# EAGLE design blackmagic_richardeoin (EAGLE 7.3.0)
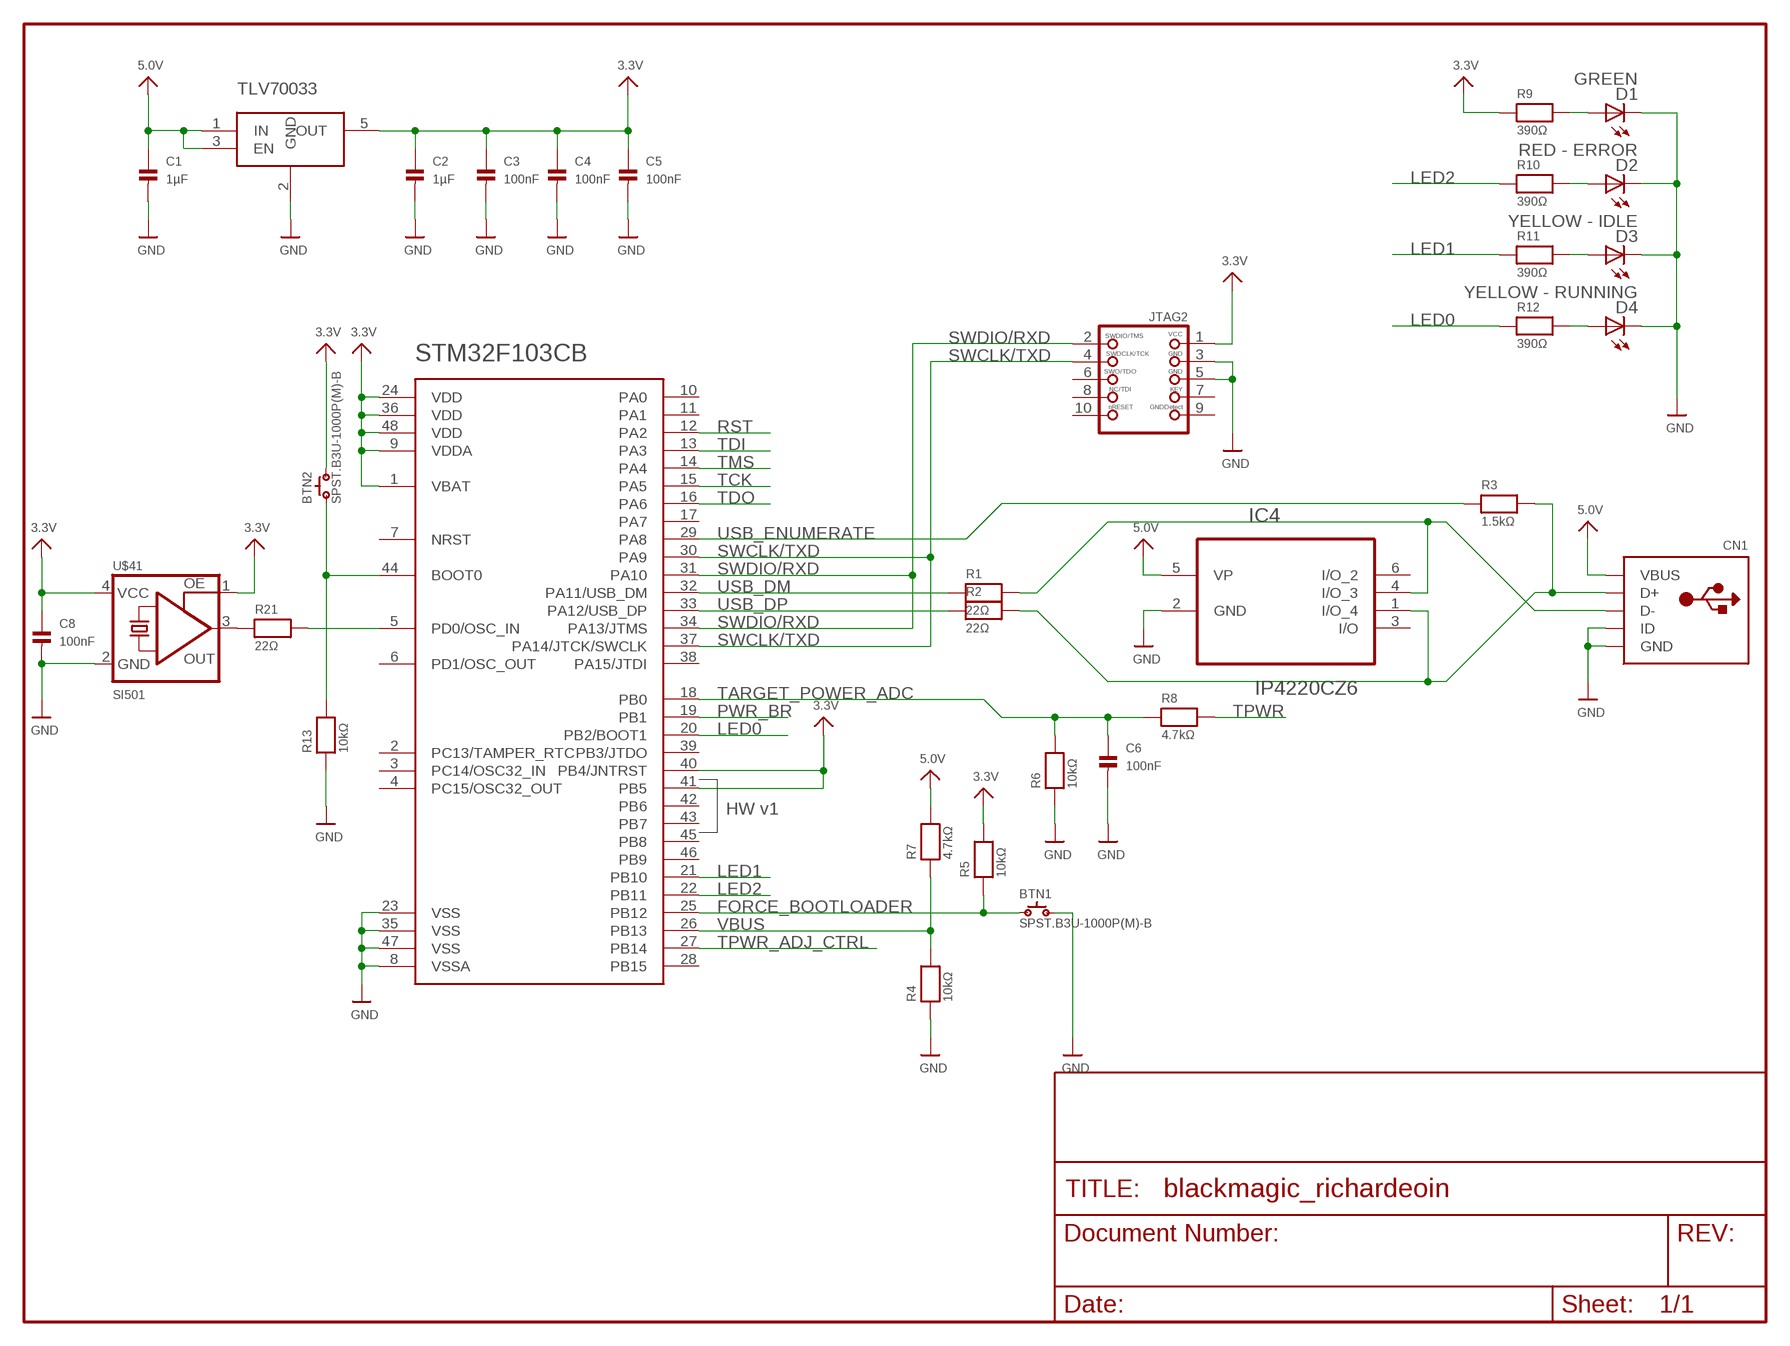
[diagram p0: schematic, sheet 1, part 1 of 2]
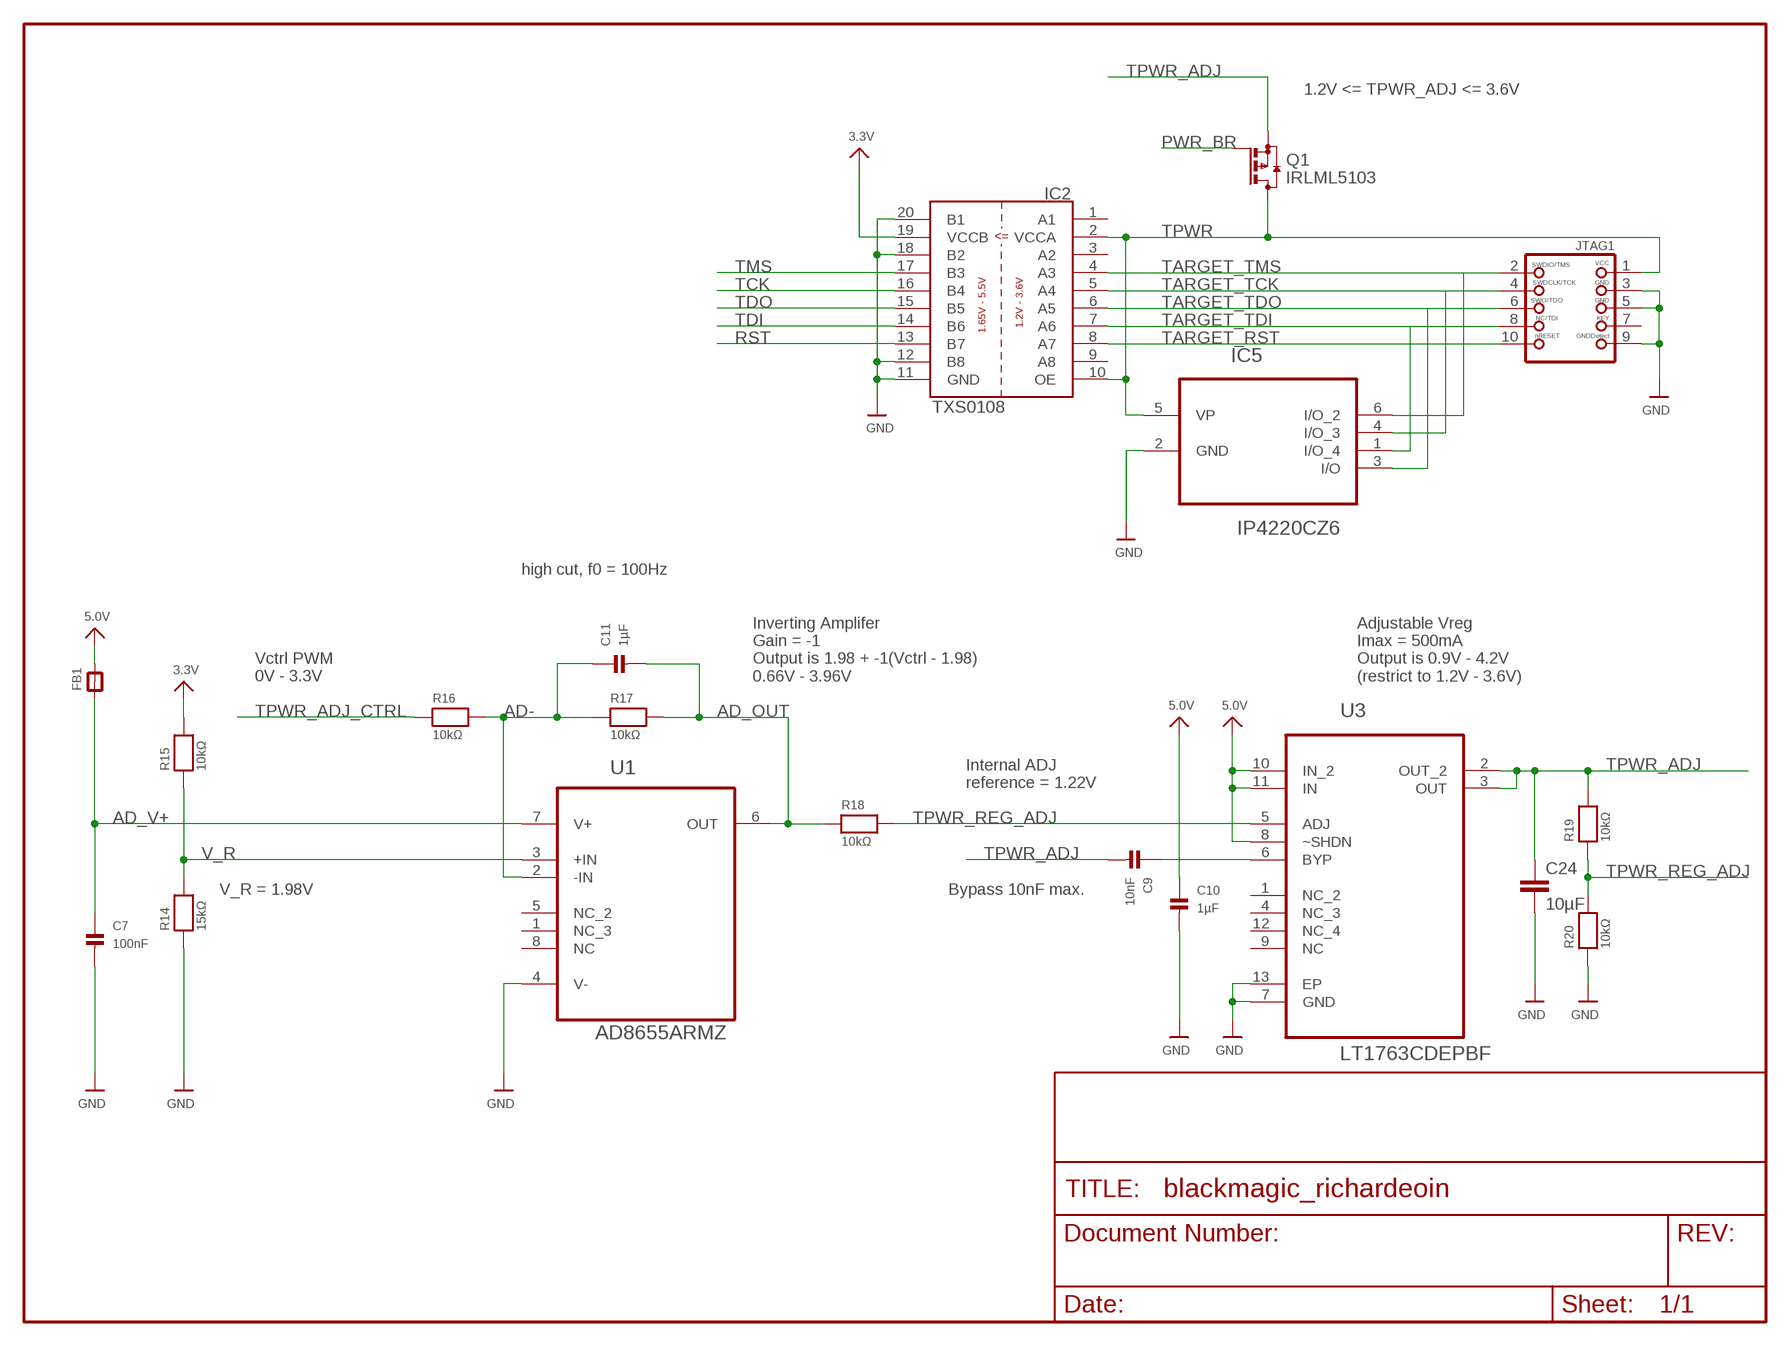
[diagram p1: schematic, sheet 1, part 2 of 2]

## Parts
BTN1  SPST.B3U-1000P(M)-B  [B3U-1000P(M)-B]
BTN2  SPST.B3U-1000P(M)-B  [B3U-1000P(M)-B]
C1  1µF  CAP_CERAMIC_0402  [_0402]
C2  1µF  CAP_CERAMIC_0402  [_0402]
C3  100nF  CAP_CERAMIC_0402  [_0402]
C4  100nF  CAP_CERAMIC_0402  [_0402]
C5  100nF  CAP_CERAMIC_0402  [_0402]
C6  100nF  CAP_CERAMIC_0402  [_0402]
C7  100nF  CAP_CERAMIC_0402  [_0402]
C8  100nF  CAP_CERAMIC_0402  [_0402]
C9  10nF  CAP_CERAMIC_0402  [_0402]
C10  1µF  CAP_CERAMIC_0402  [_0402]
C11  1µF  CAP_CERAMIC_0402  [_0402]
C24  10µF  C-EUC0603K  [C0603K]
CN1  USBMINIB  [USB-MINIB]
D1  GREEN  LEDCHIPLED_0603  [CHIPLED_0603]
D2  RED - ERROR  LEDCHIPLED_0603  [CHIPLED_0603]
D3  YELLOW - IDLE  LEDCHIPLED_0603  [CHIPLED_0603]
D4  YELLOW - RUNNING  LEDCHIPLED_0603  [CHIPLED_0603]
FB1  FERRITE_0402  [_0402]
IC1  STM32F_48PIN  [TQFP48]
IC2  TXS0108  TX0108PWR  [TSSOP20]
IC3  TLV70033DCK  TLV700DCK  [SC70-5L]
IC4  IP4220CZ6  [SOT95P275X110-6N]
IC5  IP4220CZ6  [SOT95P275X110-6N]
JTAG1  JTAG-CORTEXM3  [2X05_1.27MM_SMT]
JTAG2  JTAG-CORTEXM3  [2X05_1.27MM_SMT]
Q1  IRLML5103  BSS84  [SOT23]
R1  22Ω  RESISTOR_0402  [_0402]
R2  22Ω  RESISTOR_0402  [_0402]
R3  1.5kΩ  RESISTOR_0402  [_0402]
R4  10kΩ  RESISTOR_0402  [_0402]
R5  10kΩ  RESISTOR_0402  [_0402]
R6  10kΩ  RESISTOR_0402  [_0402]
R7  4.7kΩ  RESISTOR_0402  [_0402]
R8  4.7kΩ  RESISTOR_0402  [_0402]
R9  390Ω  RESISTOR_0402  [_0402]
R10  390Ω  RESISTOR_0402  [_0402]
R11  390Ω  RESISTOR_0402  [_0402]
R12  390Ω  RESISTOR_0402  [_0402]
R13  10kΩ  RESISTOR_0402  [_0402]
R14  15kΩ  RESISTOR_0402  [_0402]
R15  10kΩ  RESISTOR_0402  [_0402]
R16  10kΩ  RESISTOR_0402  [_0402]
R17  10kΩ  RESISTOR_0402  [_0402]
R18  10kΩ  RESISTOR_0402  [_0402]
R19  10kΩ  RESISTOR_0402  [_0402]
R20  10kΩ  RESISTOR_0402  [_0402]
R21  22Ω  RESISTOR_0402  [_0402]
U1  AD8655ARMZ  [SOP65P490X110-8N]
U3  LT1763CDEPBF  [DFN400X300X80-13N]
U$41  SI501  [SI501_2X2.5]

## Nets
3.3V: BTN2.2 C2.1 C3.1 C4.1 C5.1 IC1.1(VBAT) IC1.9(VDDA) IC1.24(VDD) IC1.36(VDD) IC1.40(PB4/JNTRST) IC1.41(PB5) IC1.48(VDD) IC2.19(VCCB) IC3.5(OUT) JTAG2.1 R5.2 R9.1 R15.2 U$41.1(OE)
5.0V: C1.1 C10.1 CN1.VBUS FB1.2 IC3.1(IN) IC3.3(EN) IC4.5(VP) R7.2 U3.8(~SHDN) U3.10(IN_2) U3.11(IN)
AD-: C11.1 R16.2 R17.1 U1.2(-IN)
AD_OUT: C11.2 R17.2 R18.1 U1.6(OUT)
AD_V+: C7.1 FB1.1 U1.7(V+)
BOOT0: BTN2.1 IC1.44(BOOT0) R13.2
FORCE_BOOTLOADER: BTN1.1 IC1.25(PB12) R5.1
GND: BTN1.2 C1.2 C2.2 C3.2 C4.2 C5.2 C6.2 C7.2 C8.2 C10.2 C24.2 CN1.GND CN1.ID D1.C D2.C D3.C D4.C IC1.8(VSSA) IC1.23(VSS) IC1.35(VSS) IC1.47(VSS) IC2.11(GND) IC2.12(B8) IC2.18(B2) IC2.20(B1) IC3.2(GND) IC4.2(GND) IC5.2(GND) JTAG1.3 JTAG1.5 JTAG1.9 JTAG2.3 JTAG2.5 R4.1 R6.1 R13.1 R14.1 R20.1 U1.4(V-) U3.7(GND) U3.13(EP) U$41.2(GND)
IC8: C8.1 U$41.4(VCC) ; supply symbol labelled 3.3V
LED0: IC1.20(PB2/BOOT1) R12.1
LED0_R: D4.A R12.2
LED1: IC1.21(PB10) R11.1
LED1_R: D3.A R11.2
LED2: IC1.22(PB11) R10.1
LED2_R: D2.A R10.2
LED3_R: D1.A R9.2
N$2: IC1.5(PD0/OSC_IN) R21.2
N$3: R21.1 U$41.3(OUT)
PWR_BR: IC1.19(PB1) Q1.1(G)
RST: IC1.12(PA2) IC2.13(B7)
SWCLK/TXD: IC1.30(PA9) IC1.37(PA14/JTCK/SWCLK) JTAG2.4
SWDIO/RXD: IC1.31(PA10) IC1.34(PA13/JTMS) JTAG2.2
TARGET_POWER_ADC: C6.1 IC1.18(PB0) R6.2 R8.1
TARGET_RST: IC2.8(A7) JTAG1.10
TARGET_TCK: IC2.5(A4) IC5.4(I/O_3) JTAG1.4
TARGET_TDI: IC2.7(A6) IC5.1(I/O_4) JTAG1.8
TARGET_TDO: IC2.6(A5) IC5.3(I/O) JTAG1.6
TARGET_TMS: IC2.4(A3) IC5.6(I/O_2) JTAG1.2
TCK: IC1.15(PA5) IC2.16(B4)
TDI: IC1.13(PA3) IC2.14(B6)
TDO: IC1.16(PA6) IC2.15(B5)
TMS: IC1.14(PA4) IC2.17(B3)
TPWR: IC2.2(VCCA) IC2.10(OE) IC5.5(VP) JTAG1.1 Q1.3(D) R8.2
TPWR_ADJ: C9.2 C24.1 Q1.2(S) R19.2 U3.2(OUT_2) U3.3(OUT)
TPWR_ADJ_CTRL: IC1.27(PB14) R16.1
TPWR_REG_ADJ: R18.2 R19.1 R20.2 U3.5(ADJ)
TPWR_REG_BYP: C9.1 U3.6(BYP)
USB_D+: CN1.D+ IC4.1(I/O_4) R2.2 R3.2
USB_D-: CN1.D- IC4.4(I/O_3) R1.2
USB_DM: IC1.32(PA11/USB_DM) R1.1
USB_DP: IC1.33(PA12/USB_DP) R2.1
USB_ENUMERATE: IC1.29(PA8) R3.1
V_R: R14.2 R15.1 U1.3(+IN)
VBUS: IC1.26(PB13) R4.2 R7.1
Unconnected: IC1.2(PC13/TAMPER_RTC) IC1.3(PC14/OSC32_IN) IC1.4(PC15/OSC32_OUT) IC1.6(PD1/OSC_OUT) IC1.7(NRST) IC1.10(PA0) IC1.11(PA1) IC1.17(PA7) IC1.28(PB15) IC1.38(PA15/JTDI) IC1.39(PB3/JTDO) IC1.42(PB6) IC1.43(PB7) IC1.45(PB8) IC1.46(PB9) IC2.1(A1) IC2.3(A2) IC2.9(A8) IC4.3(I/O) IC4.6(I/O_2) JTAG1.7 JTAG2.6 JTAG2.7 JTAG2.8 JTAG2.9 JTAG2.10 U1.1(NC_3) U1.5(NC_2) U1.8(NC) U3.1(NC_2) U3.4(NC_3) U3.9(NC) U3.12(NC_4)

## Notes on the sheet
- TLV70033 | 1.2V <= TPWR_ADJ <= 3.6V
- STM32F103CB
- high cut, f0 = 100Hz
- Vctrl PWM
  0V - 3.3V
- Inverting Amplifer
  Gain = -1
  Output is 1.98 + -1(Vctrl - 1.98)
  0.66V - 3.96V
- Adjustable Vreg
  Imax = 500mA
  Output is 0.9V - 4.2V
  (restrict to 1.2V - 3.6V)
- Internal ADJ
  reference = 1.22V
- HW v1
- V_R = 1.98V | Bypass 10nF max.

## Library data of the parts
BTN1 BTN2 = omron:SPST
C1-C11 = microbuilder_v3:CAP_CERAMIC: Ceramic Capacitors 0402 - 0402 Surface Mount Capacitors 16pF 50V 5% [Digikey: 445-4899-2-ND] 18pF 50V 5% [Digikey: 490-1281-2-ND] 22pF 50V 5% [Digikey: 490-1283-2-ND] 68pF 50V 5% [Digikey: 490-1289-2-ND] 0.1uF 10V 10% [Digikey: 490-1318-2-ND] 1.0uF 6.3V 10% [Digikey: 490-1320-2-ND] 0603 - 0603 Surface Mount Capacitors 16 pF 50V 5% [Digikey: 445-5051-2-ND] 22 pF 50V [Digikey: PCC220ACVTR-ND] 33 pF 50V 5% [Digikey: 490-1415-1-ND] 56pF 50V 5% [Digikey: 490-1421-1-ND] 220pF 50V 5% [Digikey: 445-1285-1-ND] 680 pF 50V 2200 pF 50V 5% C0G [Digikey: 445-1297-1-ND] 5600 pF 100V 5% X7R [Digikey: 478-3711-1-ND] 0.1 µF 25V 10% [Digikey: PCC2277TR-ND] 0.22 µF 16V 10% X7R [Digikey: 445-1318-1-ND] 1.0 µF 25V 10% [Digikey: 445-5146-2-ND] 0603 - RF Specific 3pF 250V +/-0.1pF RF [Digikey: 712-1347-1-ND] 18 pF 250V 5% [Digikey: 478-3505-1-ND or 712-1322-1-ND] 56 pF 250V 5% C0G RF [Digikey: 490-4867-1-ND] 68 pF 250V RF [Digikey: 490-4868-1-ND] 0805 - 0805 Surface Mount Capacitors 220 pF 250V 2% RF Ceramic Capacitor [Digikey: 712-1398-1-ND] 1000 pF 50V 2% NP0 Ceramic Capacitor [Digikey: 478-3760-1-ND] 0.1 µF 25V 10% Ceramic Capacitor [Digikey: PCC1828TR-ND] 1.0 µF 16V 10% Ceramic Capacitor[Digikey: 490-1691-2-ND] 10.0 µF 10V 10% Ceramic Capacitor[Digikey: 709-1228-1-ND] 10.0 uF 16V 10% Ceramic Capacitor [Digikey: 478-5165-2-ND] 47 uF 6.3V 20% Ceramic Capacitor [Digikey: 587-1779-1-ND or 399-5506-1-ND] 1206 - 1206 Surface Mount Capacitors 47uF 10V 20% Ceramic Capacitor [Digikey: 490-5528-1-ND or 399-5508-1-ND or 445-6010-1-ND] 100uF 6.3V -20%, +80% Y5V Ceramic Capacitor (Digikey: 490-4512-1-ND, Mouser: 81-GRM31CF50J107ZE1L)
C24 = resistor:C-EU: CAPACITOR, European symbol
CN1 = microbuilder_v3:USB: USB Connectors USBMINIB - Surface Mount Female Mini-B USB Connector 4UConnector: 06564
D1-D4 = led:LED: LED OSRAM: - CHIPLED LG R971, LG N971, LY N971, LG Q971, LY Q971, LO R971, LY R971 LH N974, LH R974 LS Q976, LO Q976, LY Q976 LO Q996 - Hyper CHIPLED LW Q18S LB Q993, LB Q99A, LB R99A - SideLED LS A670, LO A670, LY A670, LG A670, LP A670 LB A673, LV A673, LT A673, LW A673 LH A674 LY A675 LS A676, LA A676, LO A676, LY A676, LW A676 LS A679, LY A679, LG A679 - Hyper Micro SIDELED® LS Y876, LA Y876, LO Y876, LY Y876 LT Y87S - SmartLED LW L88C, LW L88S LB L89C, LB L89S, LG L890 LS L89K, LO L89K, LY L89K LS L896, LA L896, LO L896, LY L896 - TOPLED LS T670, LO T670, LY T670, LG T670, LP T670 LSG T670, LSP T670, LSY T670, LOP T670, LYG T670 LG T671, LOG T671, LSG T671 LB T673, LV T673, LT T673, LW T673 LH T674 LS T676, LA T676, LO T676, LY T676, LB T676, LH T676, LSB T676, LW T676 LB T67C, LV T67C, LT T67C, LS T67K, LO T67K, LY T67K, LW E67C LS E67B, LA E67B, LO E67B, LY E67B, LB E67C, LV E67C, LT E67C LW T67C LS T679, LY T679, LG T679 LS T770, LO T770, LY T770, LG T770, LP T770 LB T773, LV T773, LT T773, LW T773 LH T774 LS E675, LA E675, LY E675, LS T675 LS T776, LA T776, LO T776, LY T776, LB T776 LHGB T686 LT T68C, LB T68C - Hyper Mini TOPLED® LB M676 - Mini TOPLED Santana® LG M470 LS M47K, LO M47K, LY M47K Source: http://www.osram.convergy.de LUXEON: - LUMILED® LXK2-PW12-R00, LXK2-PW12-S00, LXK2-PW14-U00, LXK2-PW14-V00 LXK2-PM12-R00, LXK2-PM12-S00, LXK2-PM14-U00 LXK2-PE12-Q00, LXK2-PE12-R00, LXK2-PE12-S00, LXK2-PE14-T00, LXK2-PE14-U00 LXK2-PB12-K00, LXK2-PB12-L00, LXK2-PB12-M00, LXK2-PB14-N00, LXK2-PB14-P00, LXK2-PB14-Q00 LXK2-PR12-L00, LXK2-PR12-M00, LXK2-PR14-Q00, LXK2-PR14-R00 LXK2-PD12-Q00, LXK2-PD12-R00, LXK2-PD12-S00 LXK2-PH12-R00, LXK2-PH12-S00 LXK2-PL12-P00, LXK2-PL12-Q00, LXK2-PL12-R00 Source: www.luxeon.com KINGBRIGHT: KA-3528ASYC Source: www.kingbright.com
FB1 = microbuilder_v3:FERRITE: Ferrite Bead 0603 MMZ1608B121C - 120 Ohm @ 100MHz, 600mA, 0.15 Ohm DC Resistance - Digikey: 445-2164-1-ND BK1608HW121-T - 120 Ohm, 600mA Ferrite Chip - Digikey: 587-1876-2-ND 0805 HZ0805B272R-10 - 2.7K Ohm @ 100MHz, 200mA, 0.8 Ohm DC Resistance - Digikey: 240-2504-1-ND (see also Murata BLM21BD272SN1L) MMZ2012Y152B - 1.5K Ohm @ 100MHz, 500mA, 0.4 Ohm DC Resistance - Digikey: 445-1560-1-ND - Mainly for high frequency (80-400MHz) MMZ2012R102A - 1K Ohm @ 100MHz, 500mA, 0.3 Ohm DC Resistance - Digikey: 445-1555-2-ND - More general purpose (10-200MHz)
IC1 = stm32f:STM32F_48PIN
IC2 = dan-translate:TX0108: TXB0108 or TXS0108
IC3 = tlv700:TLV700
IC4 IC5 = IP4220CZ6:IP4220CZ6: Dual Schmitt-Trigger Inverter; MPN: IP4220CZ6; OC_FARNELL: 1506629; OC_NEWARK: 61M6815; PACKAGE: SSOT-6; SUPPLIER: NXP
JTAG1 JTAG2 = microbuilder_v3:JTAG-CORTEXM3: Serial Wire (SW-DP) Connector This standard 0.05" 10-pin connector is for use with the Cortex M0/M3's native SWD (serial wire debugger) interface (SW-DP). Some boards support a 20-pin combined JTAG+SWD connector (SWJ-DP), such as the LPC1700 family, but many smaller devices only work with SWD which typically use the smaller 10-pin SW-DP connecter (the LPC1300 family, for example, only supports SWD). 2x05 1.27mm/0.05" Connector: This is the standard SMT connector defined by ARM for all Cortex devices, and should be used in most situations and for forward-compatibility since any new devices coming to market will likely use this connector. MOLEX 10 Pin 0.1" Connector: This 0.1" 10 pin connector has the same pin layout as the standard 0.05" connector, but is easier to work with if you are using standard jumper wires or custom cables to connect your SWD hardware. MOLEX 20 Pin 0.1" Connector: This 0.1" 20 pin connector is the same model used for ARM7/ARM9 JTAG debuggers, but is connected to match the pins on the Segger J-Link for ARM (which supports both JTAG and SWD debugging). See the following document from ARM for more information on Cortex M3 Debug Connectors: http://infocenter.arm.com/help/topic/com.arm.doc.faqs/attached/13634/cortex_debug_connectors.pdf And the following page for an overview with images of the different connector types: http://www.keil.com/peripherals/coresight/connectors.asp
Q1 = transistor-small-signal:BSS84: P-CHANNEL MOS FET
R1-R21 = microbuilder_v3:RESISTOR: Resistors 0402 - 0402 Surface Mount Package 22 Ohm 1% 1/16W [Digikey: 311-22.0LRTR-ND] 33 Ohm 5% 1/16W 1.0K 5% 1/16W 1.5K 5% 1/16W 2.0K 1% 1/16W 10.0K 1% 1/16W [Digikey: 311-10.0KLRTR-ND] 10.0K 5% 1/16W [Digikey: RMCF0402JT10K0TR-ND] 12.1K 1% 1/16W [Digikey: 311-22.0LRTR-ND] 100.0K 5% 1/16W 0603 - 0603 Surface Mount Package 0 Ohm 1/10 Watt 1% Resistor 15 Ohm 1/10 Watt 1% Resistor 33 Ohm 1/10 Watt 1% Resistor 49.9 Ohm 1/10 Watt 1% Resistor 100 Ohm 1/10 Watt 1% Resistor 150 Ohm 1/10 Watt 1% Resistor 240 Ohm 1/10 Watt 1% Resistor 390 Ohm 1/10 Watt 1% Resistor 560 Ohm 1/10 Watt 1% Resistor 680 Ohm 1/10 Watt 1% Resistor 750 Ohm 1/10 Watt 1% Resistor 1.0K Ohm 1/10 Watt 1% Resistor 1.5K Ohm 1/10 Watt 1% Resistor 2.0K Ohm 1/10 Watt 1% Resistor 2.2K Ohm 1/10 Watt 1% Resistor 3.3K Ohm 1/10 Watt 1% Resistor 4.7K Ohm 1/10 Watt 1% Resistor 10.0K Ohm 1/10 Watt 1% Resistor 12.0K Ohm 1/10 Watt 1% Resistor 12.1K Ohm 1/10 Watt 1% Resistor 20.0K Ohm 1/10 Watt 1% Resistor 33.0K Ohm 1/10 Watt 1% Resistor 100.0K Ohm 1/10 Watt 1% Resistor 0805 - 0805 Surface Mount Package 0 Ohm 1/8 Watt 1% Resistor 33 Ohm 1/8 Watt 1% Resistor 100 Ohm 1/8 Watt 1% Resistor 150 Ohm 1/8 Watt 1% Resistor 200 Ohm 1/8 Watt 1% Resistor 240 Ohm 1/8 Watt 1% Resistor 330 Ohm 1/8 Watt 1% Resistor 390 Ohm 1/8 Watt 1% Resistor 470 Ohm 1/8 Watt 1% Resistor 1.0K Ohm 1/8 Watt 1% Resistor 1.5K Ohm 1/8 Watt 1% Resistor 2.0K Ohm 1/8 Watt 1% Resistor 4.7K Ohm 1/8 Watt 1% Resistor 5.1K Ohm 1/8 Watt 1% Resistor 5.6K Ohm 1/8 Watt 1% Resistor 10.0K Ohm 1/8 Watt 1% Resistor 22.0K Ohm 1/8 Watt 1% Resistor 33.0K Ohm 1/8 Watt 1% Resistor 100K Ohm 1/8 Watt 1% Resistor 1206 - 1206 Surface Mount Package 2012 - 2010 Surface Mount Package 0.11 Ohm 1/2 Watt 1% Resistor - Digikey: RHM.11UCT-ND
U1 = AD8655ARMZ:AD8655ARMZ: Precision CMOS Amplifier; MPN: AD8655ARMZ; OC_FARNELL: 2112576; OC_NEWARK: 34P3251; PACKAGE: MSOP-8; SUPPLIER: Analog Devices
U3 = LTC1763CDEPBF:LT1763CDEPBF: Micropower Regulators; MPN: LT1763CDE#PBF; OC_FARNELL: 1273613; OC_NEWARK: 57M6039; PACKAGE: DFN-12; SUPPLIER: Linear Technology
U$41 = Si501:SI501

## Board
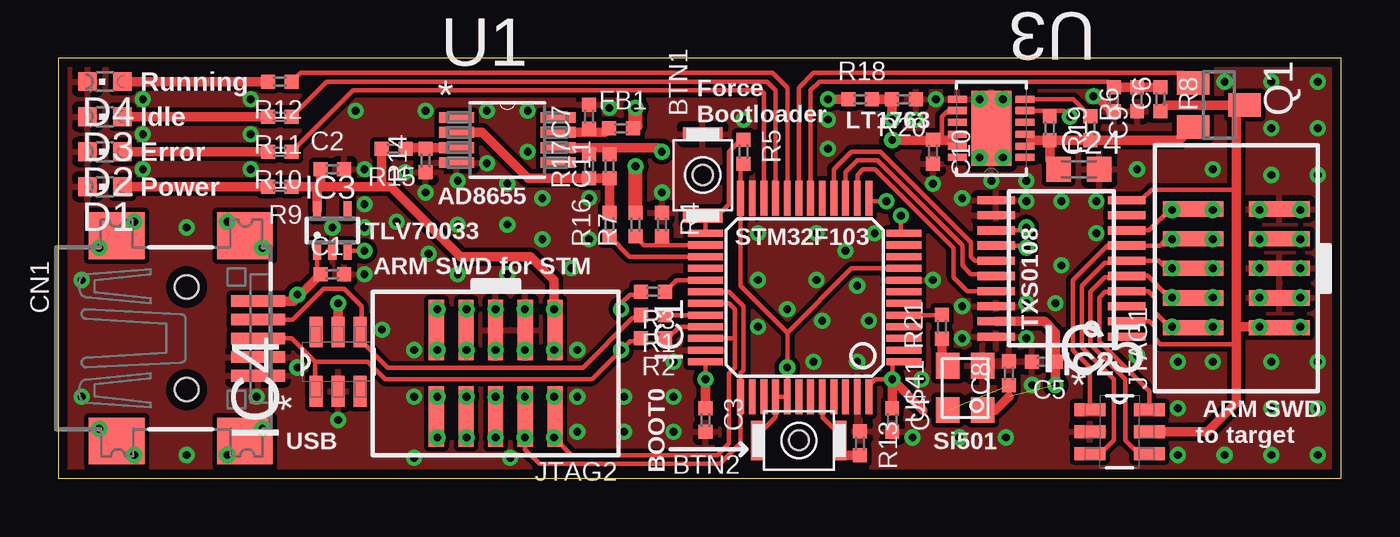
[diagram p2: board, top side]
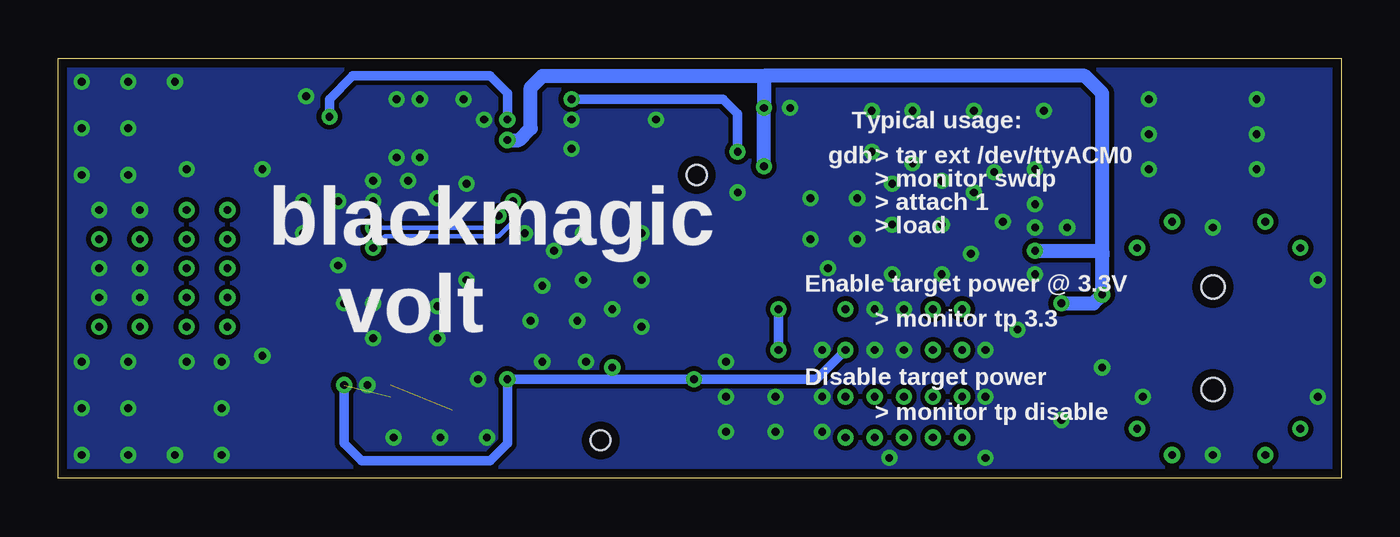
[diagram p3: board, bottom side, seen from below]

Size 55 x 18 mm. Coordinates in mm from the lower left corner, seen from the top.
Outline: 0,18 0,0 55,0 55,18 0,18
Copper layers (1*16): Top 0.0356mm / dielectric 1.5011mm / Bottom 0.0356mm
Design rules "oshpark *": minimum track width 6mil, minimum drill 13mil, track to track 6mil, track to pad 6mil, pad to pad 6mil, via to via 6mil, smd to smd 6mil, copper to edge 15mil, drill to drill 6mil, minimum pad ring 7mil, minimum via ring 7mil, stop-mask expansion 3mil, vias tented up to drill 20mil, thermal gap 10mil

### Footprints (pad centres in the part's own frame; a part is rotated, then mirrored left to right if it is on the bottom)
B3U-1000P(M)-B = smd 0.6 x 1.7: 1 -1.75,0; 2 1.75,0 | hole 0.85: 0,0
_0402 = smd 0.6 x 0.6: 1 -0.508,0; 2 0.508,0
C0603K = smd 1.05 x 1.08: 1 -0.875,0; 2 0.875,0
USB-MINIB = smd 0.5 x 2.308: D+ 0,4.064; D- -0.8,4.064; GND 1.6,4.064; ID 0.8,4.064; VBUS -1.6,4.064 | smd 2 x 2.4: GND1 -4.4,-2; GND2 -4.4,3.5; GND3 4.4,3.5; GND4 4.4,-2 | hole 1: -2.2,1; 2.2,1
CHIPLED_0603 = smd 0.8 x 0.8: A 0,-0.75; C 0,0.75
TQFP48 = smd 0.3 x 1.5: 1 -2.75,-4.25; 2 -2.25,-4.25; 3 -1.75,-4.25; 4 -1.25,-4.25; 5 -0.75,-4.25; 6 -0.25,-4.25; 7 0.25,-4.25; 8 0.75,-4.25; 9 1.25,-4.25; 10 1.75,-4.25; 11 2.25,-4.25; 12 2.75,-4.25; 25 2.75,4.25; 26 2.25,4.25; 27 1.75,4.25; 28 1.25,4.25; 29 0.75,4.25; 30 0.25,4.25; 31 -0.25,4.25; 32 -0.75,4.25; 33 -1.25,4.25; 34 -1.75,4.25; 35 -2.25,4.25; 36 -2.75,4.25 | smd 1.5 x 0.3: 13 4.25,-2.75; 14 4.25,-2.25; 15 4.25,-1.75; 16 4.25,-1.25; 17 4.25,-0.75; 18 4.25,-0.25; 19 4.25,0.25; 20 4.25,0.75; 21 4.25,1.25; 22 4.25,1.75; 23 4.25,2.25; 24 4.25,2.75; 37 -4.25,2.75; 38 -4.25,2.25; 39 -4.25,1.75; 40 -4.25,1.25; 41 -4.25,0.75; 42 -4.25,0.25; 43 -4.25,-0.25; 44 -4.25,-0.75; 45 -4.25,-1.25; 46 -4.25,-1.75; 47 -4.25,-2.25; 48 -4.25,-2.75
TSSOP20 = smd 0.35 x 1.6: 1 -2.925,-2.8; 2 -2.275,-2.8; 3 -1.625,-2.8; 4 -0.975,-2.8; 5 -0.325,-2.8; 6 0.325,-2.8; 7 0.975,-2.8; 8 1.625,-2.8; 9 2.275,-2.8; 10 2.925,-2.8; 11 2.925,2.8; 12 2.275,2.8; 13 1.625,2.8; 14 0.975,2.8; 15 0.325,2.8; 16 -0.325,2.8; 17 -0.975,2.8; 18 -1.625,2.8; 19 -2.275,2.8; 20 -2.925,2.8
SC70-5L = smd 0.35 x 0.8: 1 -0.65,-0.85; 2 0,-0.85; 3 0.65,-0.85; 4 0.65,0.85; 5 -0.65,0.85
SOT95P275X110-6N = smd 1.321 x 0.559: 1 -1.27,0.94; 2 -1.27,0; 3 -1.27,-0.94; 4 1.27,-0.94; 5 1.27,0; 6 1.27,0.94
2X05_1.27MM_SMT = smd 0.65 x 2.6: 1 -2.54,-1.85; 2 -2.54,1.85; 3 -1.27,-1.85; 4 -1.27,1.85; 5 0,-1.85; 6 0,1.85; 7 1.27,-1.85; 8 1.27,1.85; 9 2.54,-1.85; 10 2.54,1.85
SOT23 = smd 1 x 1.4: 1 -0.95,-1.1; 2 0.95,-1.1; 3 0,1.1
SOP65P490X110-8N = smd 1.499 x 0.457: 1 -2.184,0.965; 2 -2.184,0.33; 3 -2.184,-0.33; 4 -2.184,-0.965; 5 2.184,-0.965; 6 2.184,-0.33; 7 2.184,0.33; 8 2.184,0.965
DFN400X300X80-13N = smd 0.813 x 0.305: 1 -1.448,1.245; 2 -1.448,0.762; 3 -1.448,0.254; 4 -1.448,-0.254; 5 -1.448,-0.762; 6 -1.448,-1.245; 7 1.448,-1.245; 8 1.448,-0.762; 9 1.448,-0.254; 10 1.448,0.254; 11 1.448,0.762; 12 1.448,1.245 | smd 1.702 x 3.2: 13 0,0
SI501_2X2.5 = smd 1.1 x 1: 1 -0.95,-0.75; 2 0.95,-0.75; 3 0.95,0.75; 4 -0.95,0.75

### Placement (x,y rotation side)
BTN1  27.62,13 90 top
BTN2  31.75,1.62 180 top
C1  11.75,8.75 0 top
C2  11.75,13.25 0 top
C3  27.75,2.5 270 top
C4  35.75,2.5 270 top
C5  42.25,5 180 top
C6  45.25,16.25 270 top
C7  22.75,15.5 90 top
C8  40.75,4.5 90 top
C9  44.25,15 270 top
C10  37.5,14 270 top
C11  23.62,13.38 90 top
C24  43.75,13.25 0 top
CN1  4.5,6 270 top
D1  2,12.5 90 top
D2  2,14 90 top
D3  2,15.5 90 top
D4  2,17 90 top
FB1  24.12,15 0 top
IC1  32,7.75 90 top
IC2  43,9 90 top
IC3  11.75,10.62 0 top
IC4  12,5 90 top
IC5  45.5,2 0 top
JTAG1  50.5,9 90 top
JTAG2  18.75,4.5 180 top
Q1  49.75,16 270 top
R1  25.5,7 180 top
R2  25.5,6 180 top
R3  25.5,8 180 top
R4  25.88,10.88 270 top
R5  29.38,14 270 top
R6  46.25,16.25 90 top
R7  24.75,10.88 90 top
R8  47.25,16.25 270 top
R9  9.5,12.5 180 top
R10  9.5,14 180 top
R11  9.5,15.5 180 top
R12  9.5,17 180 top
R13  34.38,1.5 270 top
R14  15.75,13.62 90 top
R15  14.38,14.12 180 top
R16  23.62,10.88 90 top
R17  22.75,13.38 90 top
R18  34.38,16.25 0 top
R19  42.5,15 270 top
R20  36.25,16.25 180 top
R21  37.88,6.5 90 top
U1  19.25,14.5 0 top
U3  40,15 180 top
U$41  38.88,3.88 90 top

### Tracks (layer width: path | path; a pad name or v marks a point on that pad's centre or on a via)
3.3V  (via drill 0.33)  (1 unrouted)
  Top 0.2: IC1.36 v27.75,4.25 | v31.25,4.75 IC1.41 IC1.40 30.75,2.62 30,1.88 BTN2.2 | IC1.1 35.75,5 v35.75,4.25 35,4.25 34.75,4 IC1.48 | 31.25,5 v31.25,4.75 | v21.25,7.25 v21.25,5.5 21.25,6.31 JTAG2.1 | 31.25,6.25 29.25,8.25 IC1.24 29.25,13.37 R5.2 | 31.25,6.25 v31.25,4.75 | 31.25,6.25 34,9 IC1.9
  Top 0.4: IC2.19 42.27,6.72 42.75,6.25 C5.1 | C5.1 | U$41.1 40.17,2.92 40.75,3.5 | C5.1 v42.75,4 | 37.08,2.92 v35.75,4.25 C4.1 | v27.75,4.25 C3.1 | R9.1 11,12.5 | 11,12.5 11.25,12.5 | 11.25,12.5 14,12.5 | 14,12.5 14.25,12.5 17.25,9.5 20.25,9.5 21.25,8.5 v21.25,7.25 | C2.1 11.24,12.51 11.25,12.5 | R15.2 13.87,12.63 14,12.5 | IC3.5 11.1,12.4 11,12.5
  Bottom 0.4: 31.25,4.25 v27.75,4.25 22.5,4.25 v21.25,5.5 | 31.25,4.25 v35.75,4.25 35.75,1.5 36.5,0.75 42,0.75 42.75,1.5 v42.75,4 | 31.25,4.25 v31.25,4.75
5.0V  (via drill 0.33)
  Top 0.2: U3.11 38.55,14.32 38.38,14.5 38.55,14.68 U3.10 | U3.8 38.14,15.76 37.88,15.5 37.88,14.51 C10.1 | IC3.1 11.1,8.89 C1.1 | v13.12,9.75 12.4,9.75 IC3.3
  Top 0.4: CN1.VBUS 10.09,7.6 10.25,7.76 | 10.25,7.76 C1.1 | IC4.5 v12,7.5 | C10.1 37.63,14.5 | 37.63,14.5 38.38,14.5 | 37.63,14.5 v35.75,14.5 | v10.25,7.88 10.25,7.76
  Top 0.6: FB1.2 24.75,15.12 v24.75,15.88 | R7.2 v24.75,13.38
  Bottom 0.6: v35.75,14.5 35.25,14.5 34.75,15 34.75,16.75 34.25,17.25 24.75,17.25 | 24.75,17.25 v24.75,15.88 v24.75,13.38 | 10.25,9.75 10.25,16.5 11,17.25 24.75,17.25 | v12,7.5 10.62,7.5 v10.25,7.88 10.25,9.5 10.25,9.75 | v13.12,9.75 10.25,9.75
AD-
  Top 0.4: U1.2 18.17,14.83 20.13,12.87 R17.1 C11.1 R16.2
AD_OUT  (via drill 0.33)
  Top 0.4: R18.1 v33,16.25 | U1.6 22.75,14.17 | 22.75,14.17 23.75,14.17 | 23.75,14.17 25.7,14.17 v25.88,14 | C11.2 23.62,14.04 23.75,14.17 | R17.2 22.75,14.17
  Bottom 0.4: v33,16.25 26.5,16.25 25.88,15.62 v25.88,14
AD_V+
  Top 0.4: U1.7 22.75,14.83 | 22.75,14.83 23.45,14.83 FB1.1 | C7.1 22.75,14.83
BOOT0
  Top 0.2: IC1.44 32.75,2.62 33.5,1.88 BTN2.1
  Top 0.4: R13.2 33.5,0.99 BTN2.1
FORCE_BOOTLOADER
  Top 0.2: IC1.25 27.75,11.12 BTN1.1 28.25,11.25 28.75,11.75 28.75,14 29.26,14.51 R5.1
GND  (via drill 0.33)
  Top 0.4: v44.38,16.38 44.5,16.38 45.12,15.75
  other vias: 34.25,5 30,10.5 8.5,3.5 37.5,8.5 41.5,11.88 1,8.5 1,3.5 5.5,1 5.5,10.75 41.5,6 12,2.5 15.25,3.5 15.25,5.5 22.25,3.5 22.25,5.5 10.25,4.75 39.5,16.25 40.5,16.25 40.5,13.75 39.5,13.75 40,12.75 41.5,12.75 37.62,16.25 36.75,15.38 33,15.38 37.5,12.62 38.75,12 46.25,13.25 49.5,13.25 44.5,11.88 18.38,15.75 20.12,15.75 20.12,14 15.75,15.75 23.62,15.88 41.5,7.5 38.75,6 38.75,7.38 37,4.25 36.62,1.75 40.62,1.75 32.38,5 26.38,2 20,5.5 20,7.25 18.75,7.25 18.75,5.5 29.38,15.38 11.75,10.75 15.25,0.88 19.38,0.88 22.25,2 18.38,13.5 17.12,12.75 14.88,13.12 15.75,12.25 19.25,12.62 20.75,12 25.88,12.25 3.62,16.25 3.62,14.75 3.62,13.25 8.25,16.25 8.25,14.75 8.25,13.25 13.12,13.25 17.12,8.75 12.75,15.75 13.12,11.75 13.12,10.75 30,8.5 30,6.5 31.25,7.25 32.5,8.5 33.75,9.75 35,10.5 32.75,6.75 32.5,10.5 34.25,8.25 34.75,6.75 26.38,5 24.25,2 24.25,3.5 26.38,3.5 38.62,1.75 41.75,4 51.5,9 51.5,7.75 53.25,7.75 53.25,9 51.5,11.5 53.25,11.5 17.12,10.88 19.25,10.88 20.75,10.25 22,9 22.75,10.25 13.12,8.75 19.25,8.75 15.88,9.62 14.5,11 13.88,6.38 46.25,5.25 49.5,5 48,3 48,5 42.75,7.5 43,9.12 48,1 50,1 52,1 54,1 54,3 52,3 52,5 54,5 52,13 54,13 52,15 54,15 54,17 52,17 50,17 43,11.88 44.5,10.5 22.75,12 33,14.12
  pour Top (isolate 0.2): 0,18 55,18 55,0 0,0
  pour Bottom (isolate 0.2): 0,18 55,18 55,0 0,0
IC8  (1 unrouted)
LED0
  Top 0.2: IC1.20 31.25,16.75 30.62,17.38 10.38,17.38 R12.1
LED0_R
  Top 0.4: D4.A R12.2
LED1
  Top 0.2: IC1.21 30.75,16.62 30.38,17 11.51,17 R11.1
LED1_R
  Top 0.4: D3.A R11.2
LED2
  Top 0.2: IC1.22 30.25,16.5 30.12,16.62 12.63,16.62 R10.1
LED2_R
  Top 0.4: D2.A R10.2
LED3_R
  Top 0.4: D1.A R9.2
N$1  (via drill 0.33)
  other vias: 16.25,7.25
N$2
  Top 0.2: IC1.5 37.87,7 R21.2
N$3
  Top 0.4: R21.1 37.88,5.08 U$41.3
N$4  (via drill 0.33)
  other vias: 16.25,5.5
N$5  (via drill 0.33)
  other vias: 17.5,5.5
N$6  (via drill 0.33)
  other vias: 17.5,7.25
N$7  (via drill 0.33)
  other vias: 1.75,2.12
N$8  (via drill 0.33)
  other vias: 3.25,1
N$9  (via drill 0.33)
  other vias: 1.75,9.88
N$10  (via drill 0.33)
  other vias: 3.25,11
N$11  (via drill 0.33)
  other vias: 18.75,1.75
N$12  (via drill 0.33)
  other vias: 18.75,3.5
N$13  (via drill 0.33)
  other vias: 17.5,3.5
N$14  (via drill 0.33)
  other vias: 17.5,1.75
N$15  (via drill 0.33)
  other vias: 16.25,1.75
N$16  (via drill 0.33)
  other vias: 16.25,3.5
N$19  (via drill 0.33)
  other vias: 7.25,11
N$20  (via drill 0.33)
  other vias: 8.75,9.88
N$21  (via drill 0.33)
  other vias: 8.75,2.12
N$22  (via drill 0.33)
  other vias: 7.25,1
N$24  (via drill 0.33)
  other vias: 51.5,10.25
N$25  (via drill 0.33)
  other vias: 53.25,10.25
PWR_BR
  Top 0.2: IC1.19 31.75,16.75 32.38,17.38 48.23,17.38 Q1.1
RST  (via drill 0.33)
  Top 0.2: IC1.12 36.12,10.62 v36.12,11.25 | v41.5,10.75 41.38,10.62 IC2.13
  Bottom 0.2: v41.5,10.75 36.62,10.75 v36.12,11.25
SWCLK/TXD  (via drill 0.33)
  Top 0.2: IC1.30 28.75,8 29.38,7.38 29.38,4.62 29.25,4.5 IC1.37 29.25,1.5 28.38,0.62 20.62,0.62 20.02,1.23 20.02,1.73 | 20.02,1.73 JTAG2.4 20,2.67 v20,3.5 | 20.02,1.73 v20,1.75
SWDIO/RXD  (via drill 0.33)
  Top 0.2: IC1.34 29,6 | 29,6 29,7.25 28.75,7.5 IC1.31 | 21.29,1.71 JTAG2.2 21.29,3.46 v21.25,3.5 | 21.29,1.71 22,1 28.25,1 28.75,1.5 28.75,4.5 29,4.75 29,6 | v21.25,1.75 21.29,1.71
TARGET_POWER_ADC
  Top 0.2: IC1.18 32.25,16.62 32.62,17 45.01,17 C6.1
  Top 0.4: C6.1 R6.2 R8.1
TARGET_RST  (via drill 0.33)
  Top 0.2: IC2.8 46.75,10.62 47.66,11.54 47.75,11.54 | 47.75,11.54 JTAG1.10 49.46,11.54 v49.5,11.5 | v47.75,11.5 47.75,11.54
TARGET_TCK  (via drill 0.33)
  Top 0.2: 47.62,7.88 47.5,7.88 46.7,8.68 IC2.5 45.75,8.62 44.88,8.62 44.25,8 44.25,5.75 45.75,4.25 45.75,1.62 46.31,1.06 IC5.4 | 47.62,7.88 48.51,7.88 JTAG1.4 48.67,7.75 v49.5,7.75 | v47.75,7.75 47.62,7.88
TARGET_TDI  (via drill 0.33)
  Top 0.2: 47.75,10.27 47.52,10.27 47.23,9.97 IC2.7 44.98,9.97 43.5,8.5 43.5,5.5 44.23,4.77 IC5.1 | 47.75,10.27 JTAG1.8 49.48,10.27 v49.5,10.25 | v47.75,10.25 47.75,10.27
TARGET_TDO  (via drill 0.33)
  Top 0.2: v49.5,9 JTAG1.6 v47.75,9 47.5,9 47.17,9.32 IC2.6 45.73,9.25 44.88,9.25 43.88,8.25 43.88,5.62 45.25,4.25 45.25,1.62 44.69,1.06 IC5.3
TARGET_TMS  (via drill 0.33)
  Top 0.2: IC5.6 46.77,3.73 44.62,5.88 44.62,7.75 44.88,8 45.77,8 IC2.4 46.73,8.03 47,7.75 47,7.12 47.62,6.5 v47.75,6.5 48.61,6.5 JTAG1.2 48.71,6.46 48.75,6.5 v49.5,6.5
TCK
  Top 0.2: IC1.15 33.75,13.12 34.25,13.62 35.12,13.62 38.75,10 38.75,9.12 39.12,8.75 40.12,8.75 IC2.16
TDI  (via drill 0.33)
  Top 0.2: IC1.13 34.88,11.88 v35.5,11.88 | IC2.14 41.4,9.97 v41.5,9.88
  Bottom 0.2: v41.5,9.88 41,10.38 36.12,10.38 35.5,11 v35.5,11.88
TDO
  Top 0.2: IC1.16 33.25,13.25 34,14 35.25,14 39.12,10.12 39.12,9.5 39.3,9.32 IC2.15
TMS
  Top 0.2: IC1.14 34.25,13 34.5,13.25 35,13.25 38.38,9.88 38.38,8.62 38.98,8.03 IC2.17
TPWR  (via drill 0.33)
  Top 0.2: v53.25,6.5 52.39,6.5 JTAG1.1 52.31,6.5 v51.5,6.5 51.38,6.5 | IC2.2 46.77,6.72 47,6.5 47,6 47.25,5.75 50.5,5.75 | IC2.10 45.88,12 46.5,12 46.88,12.38 50.5,12.38
  Top 0.4: R8.2 47.51,16 Q1.3 50.5,15.65 50.5,12.38 50.5,6.5 | v51.5,6.5 50.5,6.5 | IC5.5 49.25,2 50.5,3.25 50.5,5.75 50.5,6.5
TPWR_ADJ
  Top 0.2: U3.2 41.7,14.49 U3.3
  Top 0.4: R19.2 C9.2 48.09,14.49 Q1.2 | R19.2 41.7,14.49 | C24.1 42.5,13.62 R19.2
TPWR_ADJ_CTRL
  Top 0.2: IC1.27 24.49,9.5 R16.1
TPWR_REG_ADJ  (via drill 0.33)
  Top 0.2: U3.5 42.5,15.76 | 42.5,15.76 43.11,15.76 v43.38,15.5 | R19.1 42.5,15.76
  Top 0.4: v35.75,15.38 v35.74,15.38 R20.2 R18.2
  Bottom 0.4: v35.75,15.38 35.75,16.5 36.5,17.25 42.38,17.25 43.38,16.25 v43.38,15.5
TPWR_REG_BYP
  Top 0.2: U3.6 43.51,16.25 C9.1
USB_D+  (via drill 0.33)
  Top 0.2: CN1.D+ 10,6 11,5 | 11,5 11,3.79 IC4.1 | 11,5 13.25,5 14,4.25 22.88,4.25 v24.12,5.5 24.5,5.88 24.87,5.88 R2.2 | v24.12,7.25 24.12,7.5 24.5,7.88 24.88,7.88 R3.2
  Bottom 0.4: v24.12,7.25 v24.12,5.5
USB_D-
  Top 0.2: CN1.D- 10.05,6.8 11.38,8.12 12.25,8.12 13,7.38 13,6.25 | 13,6.25 13,5.88 14.12,4.75 22.5,4.75 24.62,6.88 24.87,6.88 R1.2 | IC4.4 12.98,6.27 13,6.25
USB_DM
  Top 0.2: IC1.32 R1.1
USB_DP
  Top 0.2: IC1.33 26.63,6.5 26.12,6 R2.1
USB_ENUMERATE
  Top 0.2: IC1.29 26.51,8.5 R3.1
V_R
  Top 0.4: U1.3 15.88,14.17 | 15.88,14.17 14.93,14.17 R15.1 | R14.2 15.84,14.13 15.88,14.17
VBUS
  Top 0.2: IC1.26 25.88,10 | 25.88,10 25.12,10 R7.1 | R4.2 25.88,10

### Text on the board
tPlace: Running | Idle | Force / Bootloader | LT1763 | Error | Power | AD8655 | TXS0108 | TLV70033 | STM32F103 | ARM SWD for STM | ARM SWD / to target | USB | Si501 | BOOT0
bPlace: Typical usage: | > tar ext /dev/ttyACM0 | gdb | > attach 1 | > monitor swdp | > load | blackmagic | Enable target power @ 3.3V | > monitor tp 3.3 | volt | Disable target power | > monitor tp disable